# EAGLE design idealdiode (2) (EAGLE 9.6.2)
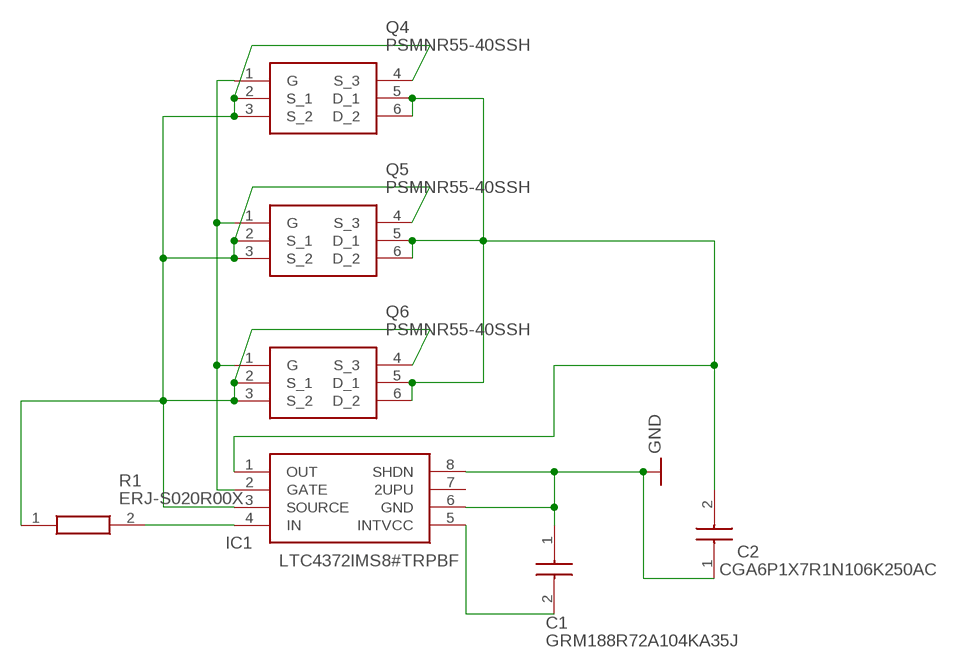
[diagram p0: schematic, sheet 1]

## Parts
C1  GRM188R72A104KA35J  [CAPC1608X90N]
C2  CGA6P1X7R1N106K250AC  [CAPC3225X280N]
IC1  LTC4372IMS8#TRPBF  [SOP65P490X110-8N]
Q4  PSMNR55-40SSH  [PSMNR5540SSH]
Q5  PSMNR55-40SSH  [PSMNR5540SSH]
Q6  PSMNR55-40SSH  [PSMNR5540SSH]
R1  ERJ-S020R00X  [ERJS02_U02_(0402)]

## Nets
GND: C1.1 C2.1 IC1.6(GND) IC1.8(SHDN)
N$1: IC1.2(GATE) Q4.1(G) Q5.1(G) Q6.1(G)
N$2: IC1.3(SOURCE) Q4.2(S_1) Q4.3(S_2) Q4.4(S_3) Q5.2(S_1) Q5.3(S_2) Q5.4(S_3) Q6.2(S_1) Q6.3(S_2) Q6.4(S_3) R1.1
N$3: C2.2 IC1.1(OUT) Q4.5(D_1) Q4.6(D_2) Q5.5(D_1) Q5.6(D_2) Q6.5(D_1) Q6.6(D_2)
N$4: C1.2 IC1.5(INTVCC)
N$5: IC1.4(IN) R1.2
Unconnected: IC1.7(2UPU)

## Library data of the parts
C1 = SamacSys_Parts:GRM188R72A104KA35J: Multilayer Ceramic Capacitors MLCC - SMD/SMT 0.1uF 100Volts X7R 0.1 Source: Datasheet <http://componentsearchengine.com/Datasheets/1/GRM188R72A104KA35J.pdf>; ARROW_PART_NUMBER: GRM188R72A104KA35J; ARROW_PRICE-STOCK: https://www.arrow.com/en/products/grm188r72a104ka35j/murata-manufacturing?region=nac; DESCRIPTION: Multilayer Ceramic Capacitors MLCC - SMD/SMT 0.1uF 100Volts X7R 0.1; HEIGHT: 0.9mm; MANUFACTURER_NAME: Murata Electronics; MANUFACTURER_PART_NUMBER: GRM188R72A104KA35J; MOUSER_PART_NUMBER: 81-GRM188R72A104KA5J; MOUSER_PRICE-STOCK: https://www.mouser.co.uk/ProductDetail/Murata-Electronics/GRM188R72A104KA35J?qs=UOvNgVTuGCrukYVcakHH%252BA%3D%3D
C2 = SamacSys_Parts:CGA6P1X7R1N106K250AC: Multilayer Ceramic Chip Capacitors, Capacitance=10uF, LxWxT:3.2x2.5x2.5mm Source: Datasheet <https://product.tdk.com/system/files/dam/doc/product/capacitor/ceramic/mlcc/catalog/mlcc_automotive_general_en.pdf>; ARROW_PART_NUMBER: CGA6P1X7R1N106K250AC; ARROW_PRICE-STOCK: https://www.arrow.com/en/products/cga6p1x7r1n106k250ac/tdk?region=europe; DESCRIPTION: Multilayer Ceramic Chip Capacitors, Capacitance=10uF, LxWxT:3.2x2.5x2.5mm; HEIGHT: 2.8mm; MANUFACTURER_NAME: TDK; MANUFACTURER_PART_NUMBER: CGA6P1X7R1N106K250AC; MOUSER_PART_NUMBER: 810-CGA6P1X7R1N106K2; MOUSER_PRICE-STOCK: https://www.mouser.co.uk/ProductDetail/TDK/CGA6P1X7R1N106K250AC?qs=PzGy0jfpSMuJjJ6Wlu9qRA%3D%3D
IC1 = SamacSys_Parts:LTC4372IMS8#TRPBF: Power Management Specialized - PMIC Low Icc Ideal Diode Controller w/SHDN Source: Datasheet <https://www.arrow.com/en/products/ltc4372ims8trpbf/analog-devices>; ARROW_PART_NUMBER: LTC4372IMS8#TRPBF; ARROW_PRICE-STOCK: https://www.arrow.com/en/products/ltc4372ims8trpbf/analog-devices?region=nac; DESCRIPTION: Power Management Specialized - PMIC Low Icc Ideal Diode Controller w/SHDN; HEIGHT: 1.1mm; MANUFACTURER_NAME: Analog Devices; MANUFACTURER_PART_NUMBER: LTC4372IMS8#TRPBF; MOUSER_PART_NUMBER: 584-LTC4372IMS8TRPBF; MOUSER_PRICE-STOCK: https://www.mouser.co.uk/ProductDetail/Analog-Devices/LTC4372IMS8TRPBF?qs=T94vaHKWudTwymNST%2FXaWA%3D%3D
Q4-Q6 = SamacSys_Parts:PSMNR55-40SSH: N-channel 40 V, 0.55 mOhm, 500 Amps continuous, standard level MOSFET in LFPAK88 using NextPowerS3 Technology Source: Datasheet <https://www.nexperia.com/products/mosfets/power-mosfets/PSMNR55-40SSH.html>; DESCRIPTION: N-channel 40 V, 0.55 mOhm, 500 Amps continuous, standard level MOSFET in LFPAK88 using NextPowerS3 Technology; HEIGHT: 1.85mm; MANUFACTURER_NAME: Nexperia; MANUFACTURER_PART_NUMBER: PSMNR55-40SSH
R1 = SamacSys_Parts:ERJ-S020R00X: Thick Film Resistors - SMD 0402 Zero ohm Jumper 0.05ohm AEC-Q200 Source: Datasheet <https://industrial.panasonic.com/cdbs/www-data/pdf/RDP0000/AOA0000C334.pdf>; ARROW_PART_NUMBER: ERJ-S020R00X; ARROW_PRICE-STOCK: https://www.arrow.com/en/products/erj-s020r00x/panasonic?region=nac; DESCRIPTION: Thick Film Resistors - SMD 0402 Zero ohm Jumper 0.05ohm AEC-Q200; HEIGHT: 0.4mm; MANUFACTURER_NAME: Panasonic; MANUFACTURER_PART_NUMBER: ERJ-S020R00X; MOUSER_PART_NUMBER: 667-ERJ-S020R00X; MOUSER_PRICE-STOCK: https://www.mouser.co.uk/ProductDetail/Panasonic/ERJ-S020R00X?qs=Zyl8A9hlmJqcGEcH0dtAYQ%3D%3D

## Board
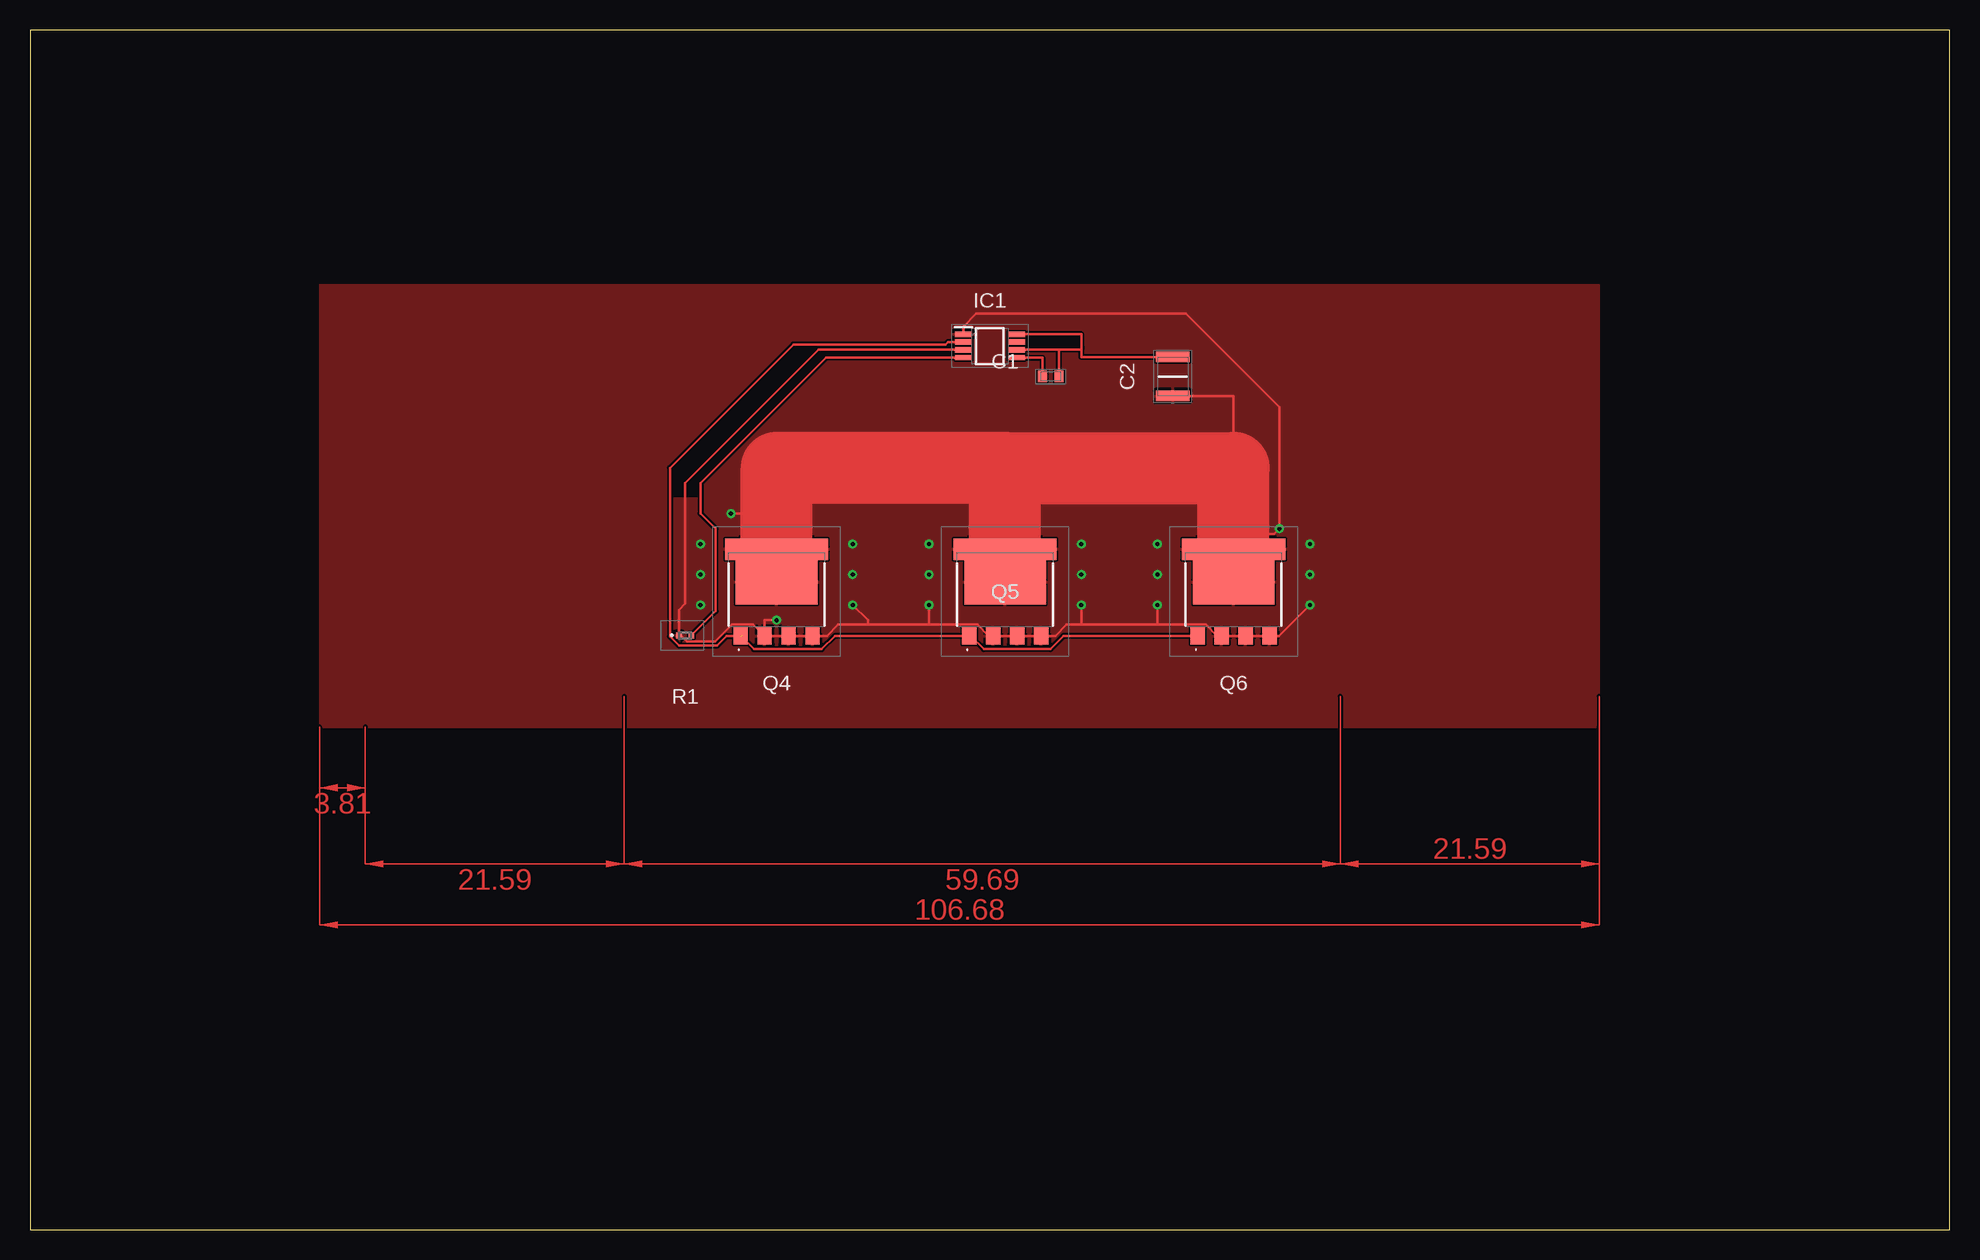
[diagram p1: board, top side]
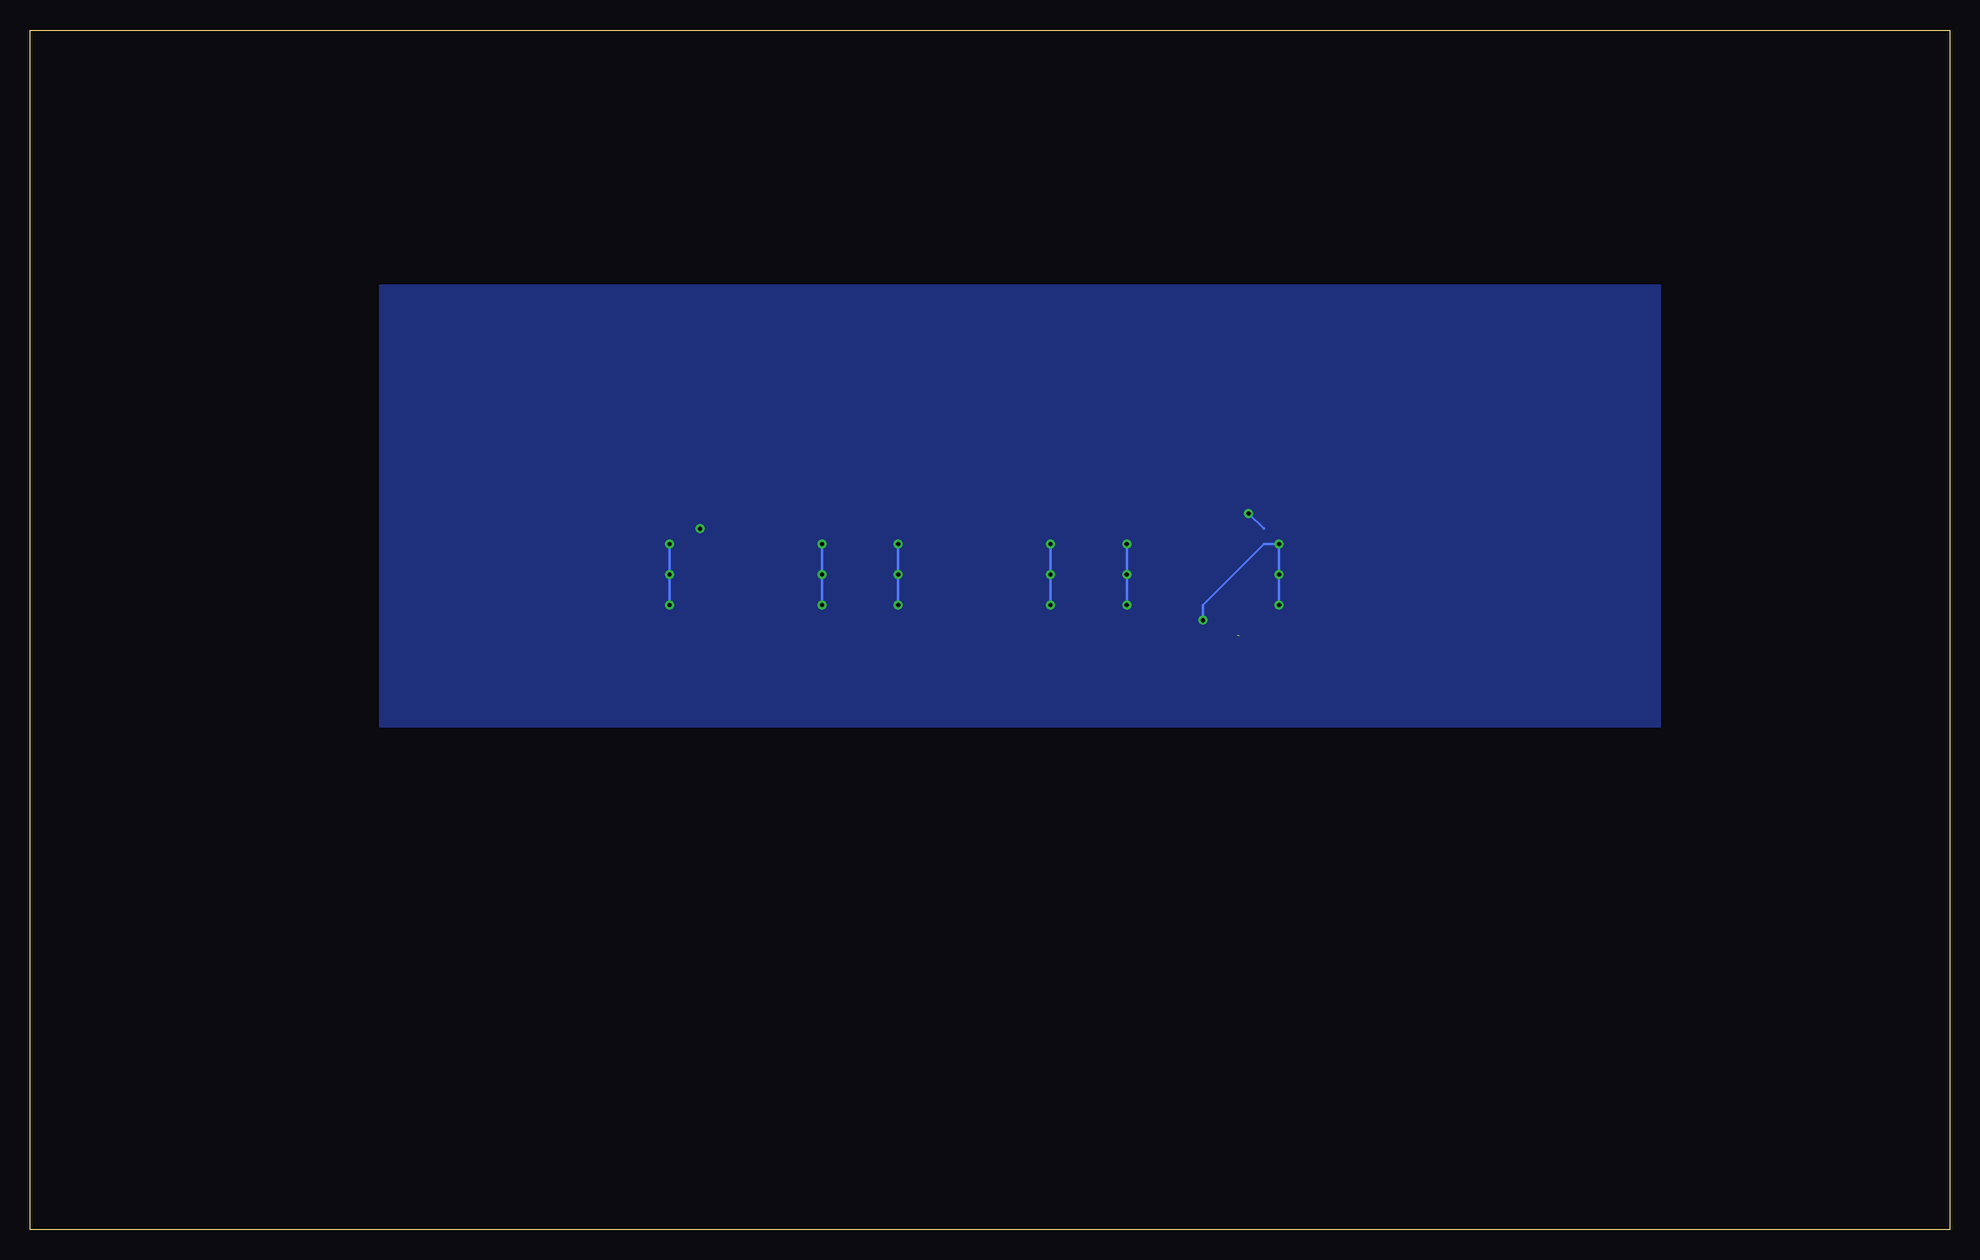
[diagram p2: board, bottom side, seen from below]

Size 160 x 100 mm. Coordinates in mm from the lower left corner, seen from the top.
Outline: 0,0 160,0 160,100 0,100 0,0
Copper layers (1*16): Top 0.035mm / dielectric 1.5mm / Bottom 0.035mm
Design rules "default": minimum track width 6mil, minimum drill 0.35mm, track to track 6mil, track to pad 6mil, pad to pad 6mil, via to via 6mil, smd to smd 6mil, copper to edge 40mil, drill to drill 6mil, minimum pad ring 10mil, minimum via ring 8mil, stop-mask expansion 4mil, vias tented up to drill 0mil, thermal gap 10mil

### Footprints (pad centres in the part's own frame; a part is rotated, then mirrored left to right if it is on the bottom)
CAPC1608X90N = smd 0.75 x 0.94: 1 -0.7,0; 2 0.7,0
CAPC3225X280N = smd 0.86 x 2.82: 1 -1.63,0; 2 1.63,0
SOP65P490X110-8N = smd 1.425 x 0.45: 1 -2.212,0.975; 2 -2.212,0.325; 3 -2.212,-0.325; 4 -2.212,-0.975; 5 2.212,-0.975; 6 2.212,-0.325; 7 2.212,0.325; 8 2.212,0.975
PSMNR5540SSH = smd 1.2 x 1.4: 1 -3,-3.85; 2 -1,-3.85; 3 1,-3.85; 4 3,-3.85 | smd 8.6 x 1.76: 5 0,3.37 | smd 6.8 x 3.74: 6 0,0.62
ERJS02_U02_(0402) = smd 0.475 x 0.5: 1 -0.512,0; 2 0.512,0

### Placement (x,y rotation side)
C1  85.09,71.12 180 top
C2  95.25,71.12 270 top
IC1  80.01,73.66 0 top
Q4  62.23,53.34 0 top
Q5  81.28,53.34 0 top
Q6  100.33,53.34 0 top
R1  54.61,49.53 0 top

### Tracks (layer width: path | path; a pad name or v marks a point on that pad's centre or on a via)
GND
  Top 0.2: 87.63,73.33 85.79,73.33 | 85.79,73.33 IC1.6 | 87.63,73.33 87.63,73.66 87.63,74.64 IC1.8 | C1.1 85.79,73.33 | C2.1 87.63,72.75 87.63,73.33
  pour Top: 124.46,58.42 124.46,54.61 129.54,54.61 129.54,58.42
N$1  (1 unrouted)
  Top 0.2: Q6.1 86.16,49.49 85.05,48.38 79.51,48.38 78.41,49.49 Q5.1 67.11,49.49 66,48.38 60.34,48.38 Q4.1 58.07,49.49 57.26,48.67 54.11,48.67 53.34,49.44 53.34,63.5 63.63,73.79 76.33,73.79 76.53,73.98 IC1.2 | 59.35,49.53 59.35,49.54 59.34,49.53
N$2  (via drill 0.35)
  Top 0.2: Q4.2 Q4.3 Q4.4 66.42,49.49 67.35,50.42 69.85,50.42 | IC1.3 65.72,73.33 54.61,62.23 54.61,52.18 54.1,51.66 R1.1 54.28,49.53 54.78,49.03 57.11,49.03 58.52,50.44 60.28,50.44 Q4.2 | 69.85,50.42 74.93,50.42 | 74.93,50.42 78.97,50.42 79.9,49.49 Q5.2 Q5.3 Q5.4 85.47,49.49 86.4,50.42 87.63,50.42 | 87.63,50.42 93.98,50.42 | 93.98,50.42 98.03,50.42 98.95,49.49 Q6.2 Q6.3 Q6.4 104.1,49.49 v106.68,52.07 | v68.58,52.07 69.85,50.8 69.85,50.42 | v74.93,52.07 74.93,50.42 | v93.98,52.07 93.98,50.42 | v87.63,52.07 87.63,50.42 | Q4.2 61.23,50.8 v62.23,50.8
  Bottom 0.2: v55.88,52.07 v55.88,54.61 v55.88,57.15 57.15,57.15 62.23,52.07 v62.23,50.8 | v68.58,57.15 v68.58,54.61 v68.58,52.07 | v74.93,57.15 v74.93,54.61 v74.93,52.07 | v87.63,57.15 v87.63,54.61 v87.63,52.07 | v93.98,57.15 v93.98,54.61 v93.98,52.07 | v106.68,57.15 v106.68,54.61 v106.68,52.07
  pour Top: 49.53,60.96 109.22,60.96 109.22,44.45 49.53,44.45
  pour Bottom: 49.53,60.96 49.53,44.45 109.22,44.45 109.22,60.96
  pour Top: 30.48,49.53 30.48,53.34 25.4,53.34 25.4,49.53
N$3  (via drill 0.35)
  Top 0.2: Q4.6 Q4.5 59.25,59.69 v58.42,59.69 | Q6.6 Q6.5 101.6,57.98 103.7,57.98 v104.14,58.42 104.14,68.58 96.36,76.36 78.88,76.36 77.8,75.28 IC1.1 | C2.2 100.33,69.49 100.33,63.5 | Q5.6 Q5.5
  Top 6: Q4.5 62.23,63.5 81.28,63.5 | Q5.5 81.28,63.5 | Q6.5 100.33,63.5 81.28,63.5
  Bottom 0.2: 57.15,58.42 v58.42,59.69
  pour Top: 24.13,78.74 24.13,41.91 130.81,41.91 130.81,78.74
  pour Bottom: 24.13,78.74 24.13,41.91 130.81,41.91 130.81,78.74
  pour Top: 25.4,57.15 25.4,60.96 30.48,60.96 30.48,57.15
N$4
  Top 0.2: IC1.5 84.39,72.69 C1.2
N$5
  Top 0.2: IC1.4 66.33,72.69 55.88,62.23 55.88,59.69 57.15,58.42 57.15,51.56 R1.2
(copper drawn outside any net)
  shapes: Top area x5